# EAGLE schematic gyrotestbench (EAGLE 6.2)

## Sheet 1 of 9
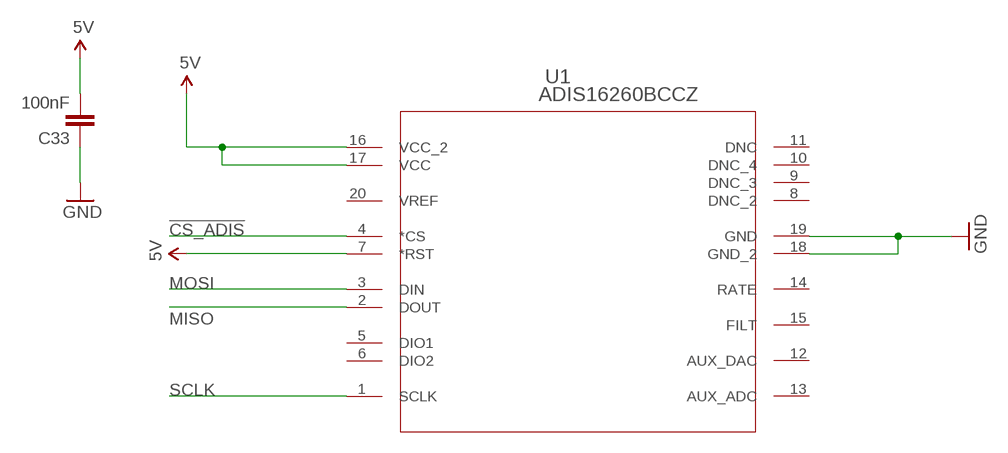
[diagram p0: schematic, sheet 1]

### Parts
C33  100nF  CAP0603-CAP  [0603-CAP]
U1  ADIS16260BCCZ  [LGA_CC-20-1]

### Nets
5V: C33.2 U1.7(*RST) U1.16(VCC_2) U1.17(VCC) ; also sheet 2,3,7,8,9
!CS_ADIS: U1.4(*CS) ; also sheet 9
GND: C33.1 U1.18(GND_2) U1.19(GND) ; also sheet 2,3,4,5,6,7,8,9
MISO: U1.2(DOUT) ; also sheet 2,7,9
MOSI: U1.3(DIN) ; also sheet 2,7,9
SCLK: U1.1(SCLK) ; also sheet 2,7,9
Unconnected: U1.5(DIO1) U1.6(DIO2) U1.8(DNC_2) U1.9(DNC_3) U1.10(DNC_4) U1.11(DNC) U1.12(AUX_DAC) U1.13(AUX_ADC) U1.14(RATE) U1.15(FILT) U1.20(VREF)

## Sheet 2 of 9
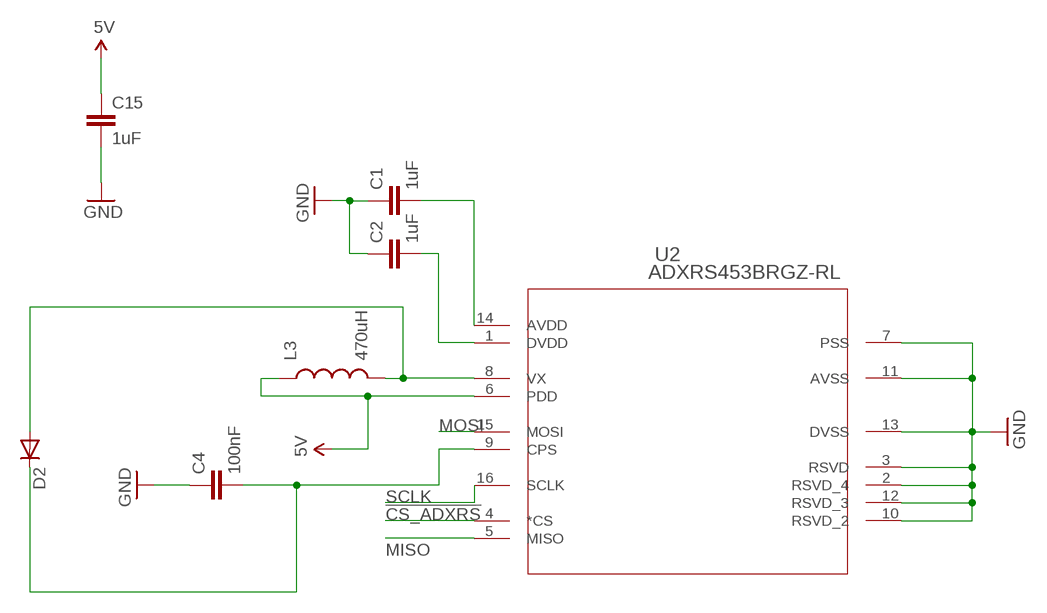
[diagram p1: schematic, sheet 2]

### Parts
C1  1uF  CAP0603-CAP  [0603-CAP]
C2  1uF  CAP0603-CAP  [0603-CAP]
C4  100nF  CAP0603-CAP  [0603-CAP]
C15  1uF  CAP0603-CAP  [0603-CAP]
D2  DIODEPTH  [DIODE-1N4001]
L3  470uH  INDUCTOR1210  [1210]
U2  ADXRS453BRGZ-RL  [RG_16_1]

### Nets
5V: C15.1 L3.1 U2.6(PDD) ; also sheet 1,3,7,8,9
!CS_ADXRS: U2.4(*CS) ; also sheet 9
GND: C1.1 C2.1 C4.1 C15.2 U2.2(RSVD_4) U2.3(RSVD) U2.7(PSS) U2.10(RSVD_2) U2.11(AVSS) U2.12(RSVD_3) U2.13(DVSS) ; also sheet 1,3,4,5,6,7,8,9
MISO: U2.5(MISO) ; also sheet 1,7,9
MOSI: U2.15(MOSI) ; also sheet 1,7,9
N$1: C1.2 U2.14(AVDD)
N$2: C2.2 U2.1(DVDD)
N$3: C4.2 D2.C U2.9(CPS)
N$4: D2.A L3.2 U2.8(VX)
SCLK: U2.16(SCLK) ; also sheet 1,7,9

## Sheet 3 of 9
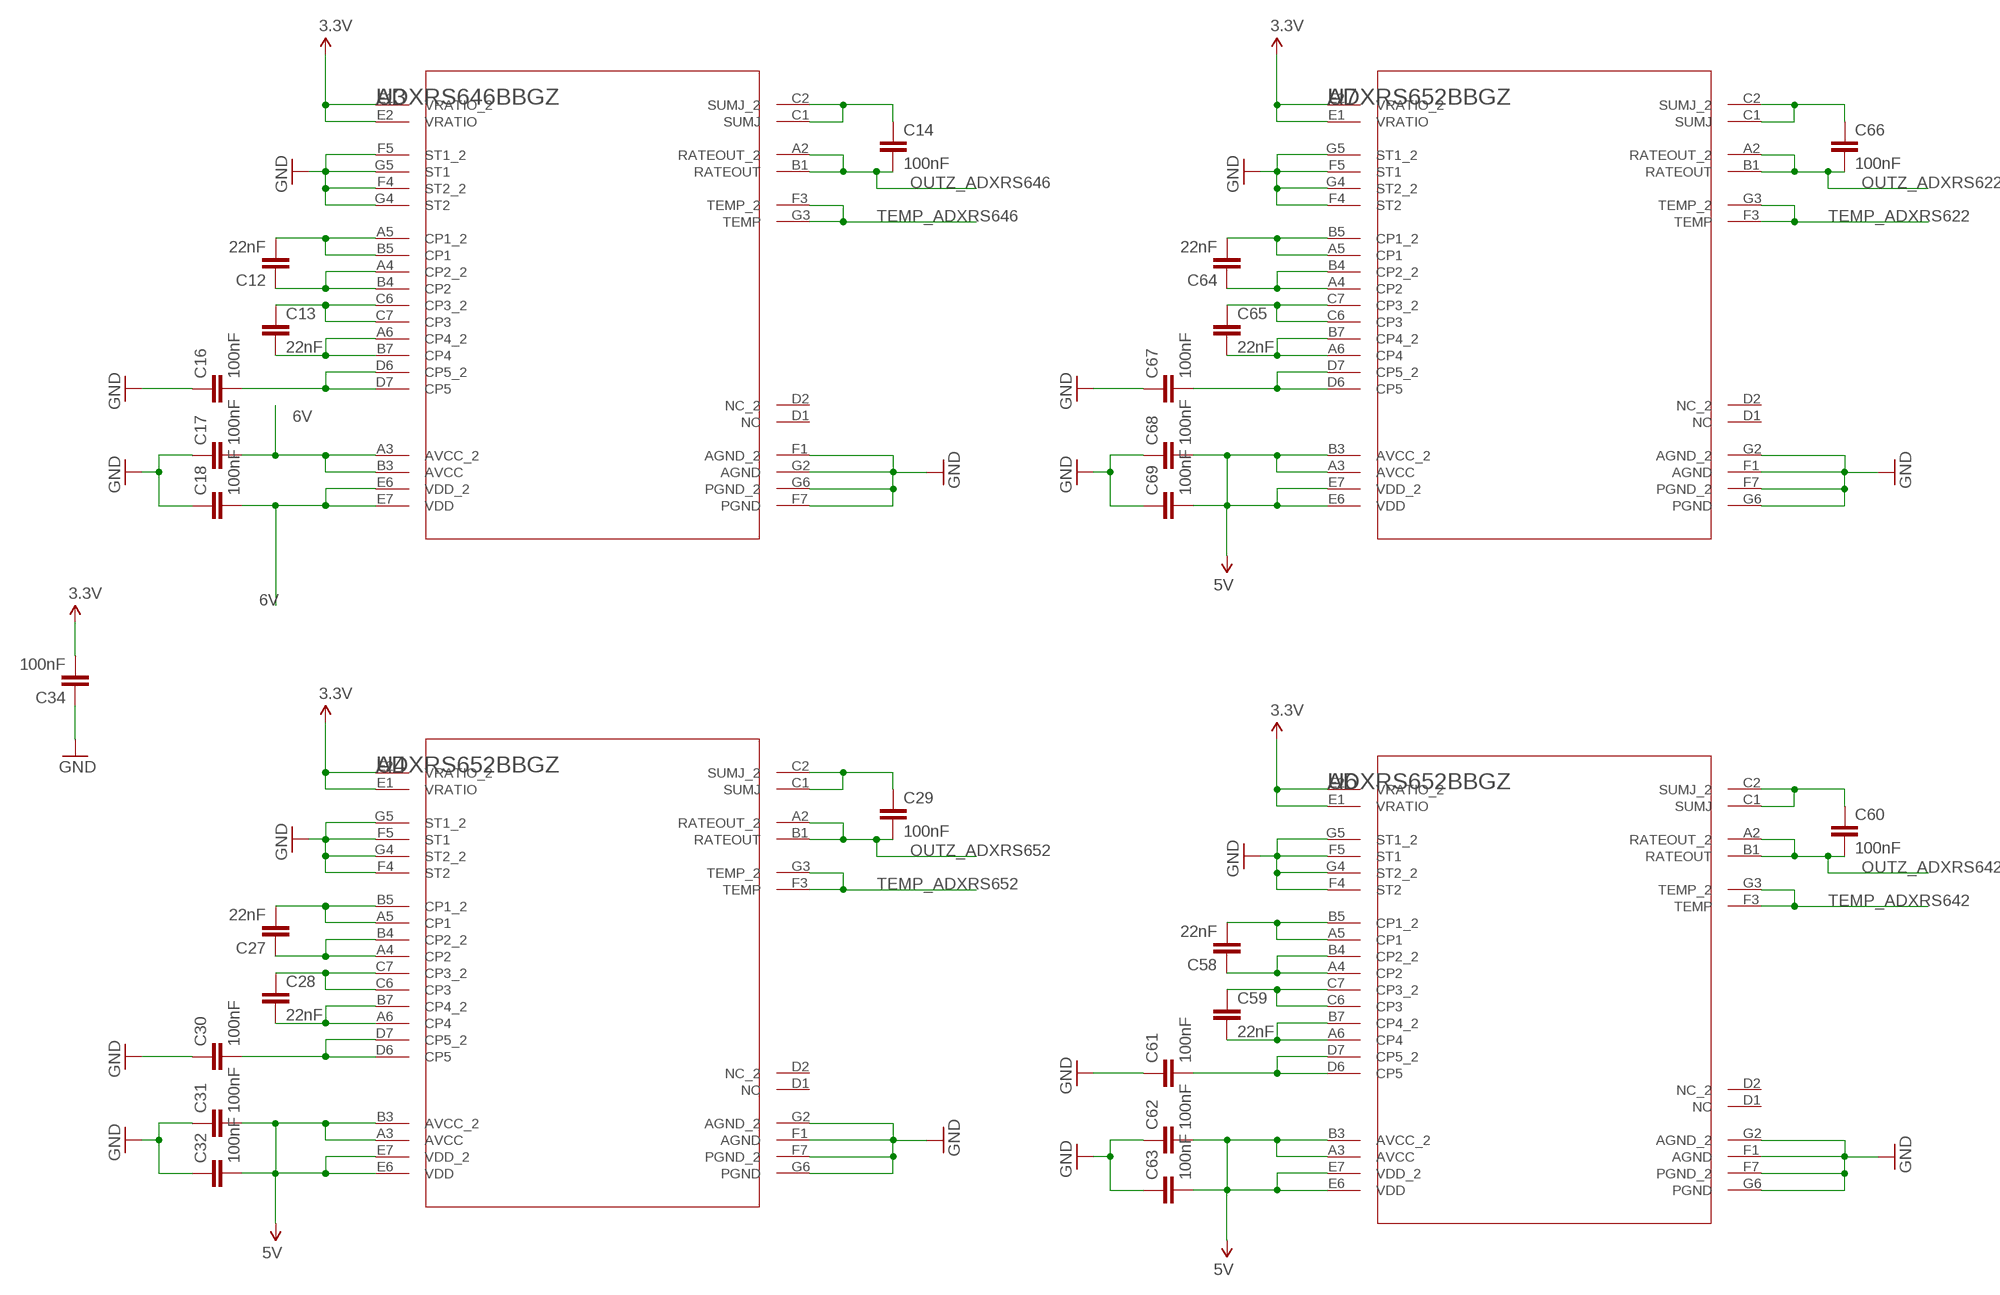
[diagram p2: schematic, sheet 3]

### Parts
C12  22nF  CAP0603-CAP  [0603-CAP]
C13  22nF  CAP0603-CAP  [0603-CAP]
C14  100nF  CAP0603-CAP  [0603-CAP]
C16  100nF  CAP0603-CAP  [0603-CAP]
C17  100nF  CAP0603-CAP  [0603-CAP]
C18  100nF  CAP0603-CAP  [0603-CAP]
C27  22nF  CAP0603-CAP  [0603-CAP]
C28  22nF  CAP0603-CAP  [0603-CAP]
C29  100nF  CAP0603-CAP  [0603-CAP]
C30  100nF  CAP0603-CAP  [0603-CAP]
C31  100nF  CAP0603-CAP  [0603-CAP]
C32  100nF  CAP0603-CAP  [0603-CAP]
C34  100nF  CAP0603-CAP  [0603-CAP]
C58  22nF  CAP0603-CAP  [0603-CAP]
C59  22nF  CAP0603-CAP  [0603-CAP]
C60  100nF  CAP0603-CAP  [0603-CAP]
C61  100nF  CAP0603-CAP  [0603-CAP]
C62  100nF  CAP0603-CAP  [0603-CAP]
C63  100nF  CAP0603-CAP  [0603-CAP]
C64  22nF  CAP0603-CAP  [0603-CAP]
C65  22nF  CAP0603-CAP  [0603-CAP]
C66  100nF  CAP0603-CAP  [0603-CAP]
C67  100nF  CAP0603-CAP  [0603-CAP]
C68  100nF  CAP0603-CAP  [0603-CAP]
C69  100nF  CAP0603-CAP  [0603-CAP]
U3  ADXRS646BBGZ  [BG_32_3]
U4  ADXRS652BBGZ  [BG_32_3]
U6  ADXRS652BBGZ  [BG_32_3]
U7  ADXRS652BBGZ  [BG_32_3]

### Nets
3.3V: C34.2 U3.E1(VRATIO_2) U3.E2(VRATIO) U4.E1(VRATIO) U4.E2(VRATIO_2) U6.E1(VRATIO) U6.E2(VRATIO_2) U7.E1(VRATIO) U7.E2(VRATIO_2) ; also sheet 4,5,6,9
5V: C31.2 C32.2 C62.2 C63.2 C68.2 C69.2 U4.A3(AVCC) U4.B3(AVCC_2) U4.E6(VDD) U4.E7(VDD_2) U6.A3(AVCC) U6.B3(AVCC_2) U6.E6(VDD) U6.E7(VDD_2) U7.A3(AVCC) U7.B3(AVCC_2) U7.E6(VDD) U7.E7(VDD_2) ; also sheet 1,2,7,8,9
6V: C17.2 C18.2 U3.A3(AVCC_2) U3.B3(AVCC) U3.E6(VDD_2) U3.E7(VDD) ; also sheet 8
GND: C16.1 C17.1 C18.1 C30.1 C31.1 C32.1 C34.1 C61.1 C62.1 C63.1 C67.1 C68.1 C69.1 U3.F1(AGND_2) U3.F4(ST2_2) U3.F5(ST1_2) U3.F7(PGND) U3.G2(AGND) U3.G4(ST2) U3.G5(ST1) U3.G6(PGND_2) U4.F1(AGND) U4.F4(ST2) U4.F5(ST1) U4.F7(PGND_2) U4.G2(AGND_2) U4.G4(ST2_2) U4.G5(ST1_2) U4.G6(PGND) U6.F1(AGND) U6.F4(ST2) U6.F5(ST1) U6.F7(PGND_2) U6.G2(AGND_2) U6.G4(ST2_2) U6.G5(ST1_2) U6.G6(PGND) U7.F1(AGND) U7.F4(ST2) U7.F5(ST1) U7.F7(PGND_2) U7.G2(AGND_2) U7.G4(ST2_2) U7.G5(ST1_2) U7.G6(PGND) ; also sheet 1,2,4,5,6,7,8,9
N$8: C12.2 U3.A5(CP1_2) U3.B5(CP1)
N$9: C12.1 U3.A4(CP2_2) U3.B4(CP2)
N$10: C13.1 U3.C6(CP3_2) U3.C7(CP3)
N$11: C13.2 U3.A6(CP4_2) U3.B7(CP4)
N$17: C14.1 U3.C1(SUMJ) U3.C2(SUMJ_2)
N$19: C16.2 U3.D6(CP5_2) U3.D7(CP5)
N$24: C27.2 U4.A5(CP1) U4.B5(CP1_2)
N$25: C27.1 U4.A4(CP2) U4.B4(CP2_2)
N$26: C28.1 U4.C6(CP3) U4.C7(CP3_2)
N$27: C28.2 U4.A6(CP4) U4.B7(CP4_2)
N$28: C29.1 U4.C1(SUMJ) U4.C2(SUMJ_2)
N$29: C30.2 U4.D6(CP5) U4.D7(CP5_2)
N$62: C58.2 U6.A5(CP1) U6.B5(CP1_2)
N$63: C58.1 U6.A4(CP2) U6.B4(CP2_2)
N$64: C59.1 U6.C6(CP3) U6.C7(CP3_2)
N$65: C59.2 U6.A6(CP4) U6.B7(CP4_2)
N$66: C60.1 U6.C1(SUMJ) U6.C2(SUMJ_2)
N$67: C61.2 U6.D6(CP5) U6.D7(CP5_2)
N$68: C64.2 U7.A5(CP1) U7.B5(CP1_2)
N$69: C64.1 U7.A4(CP2) U7.B4(CP2_2)
N$70: C65.1 U7.C6(CP3) U7.C7(CP3_2)
N$71: C65.2 U7.A6(CP4) U7.B7(CP4_2)
N$72: C66.1 U7.C1(SUMJ) U7.C2(SUMJ_2)
N$73: C67.2 U7.D6(CP5) U7.D7(CP5_2)
OUTZ_ADXRS622: C66.2 U7.A2(RATEOUT_2) U7.B1(RATEOUT) ; also sheet 7
OUTZ_ADXRS642: C60.2 U6.A2(RATEOUT_2) U6.B1(RATEOUT) ; also sheet 7
OUTZ_ADXRS646: C14.2 U3.A2(RATEOUT_2) U3.B1(RATEOUT) ; also sheet 7
OUTZ_ADXRS652: C29.2 U4.A2(RATEOUT_2) U4.B1(RATEOUT) ; also sheet 7
TEMP_ADXRS622: U7.F3(TEMP) U7.G3(TEMP_2) ; also sheet 7
TEMP_ADXRS642: U6.F3(TEMP) U6.G3(TEMP_2) ; also sheet 7
TEMP_ADXRS646: U3.F3(TEMP_2) U3.G3(TEMP) ; also sheet 7
TEMP_ADXRS652: U4.F3(TEMP) U4.G3(TEMP_2) ; also sheet 7
Unconnected: U3.D1(NC) U3.D2(NC_2) U4.D1(NC) U4.D2(NC_2) U6.D1(NC) U6.D2(NC_2) U7.D1(NC) U7.D2(NC_2)

## Sheet 4 of 9
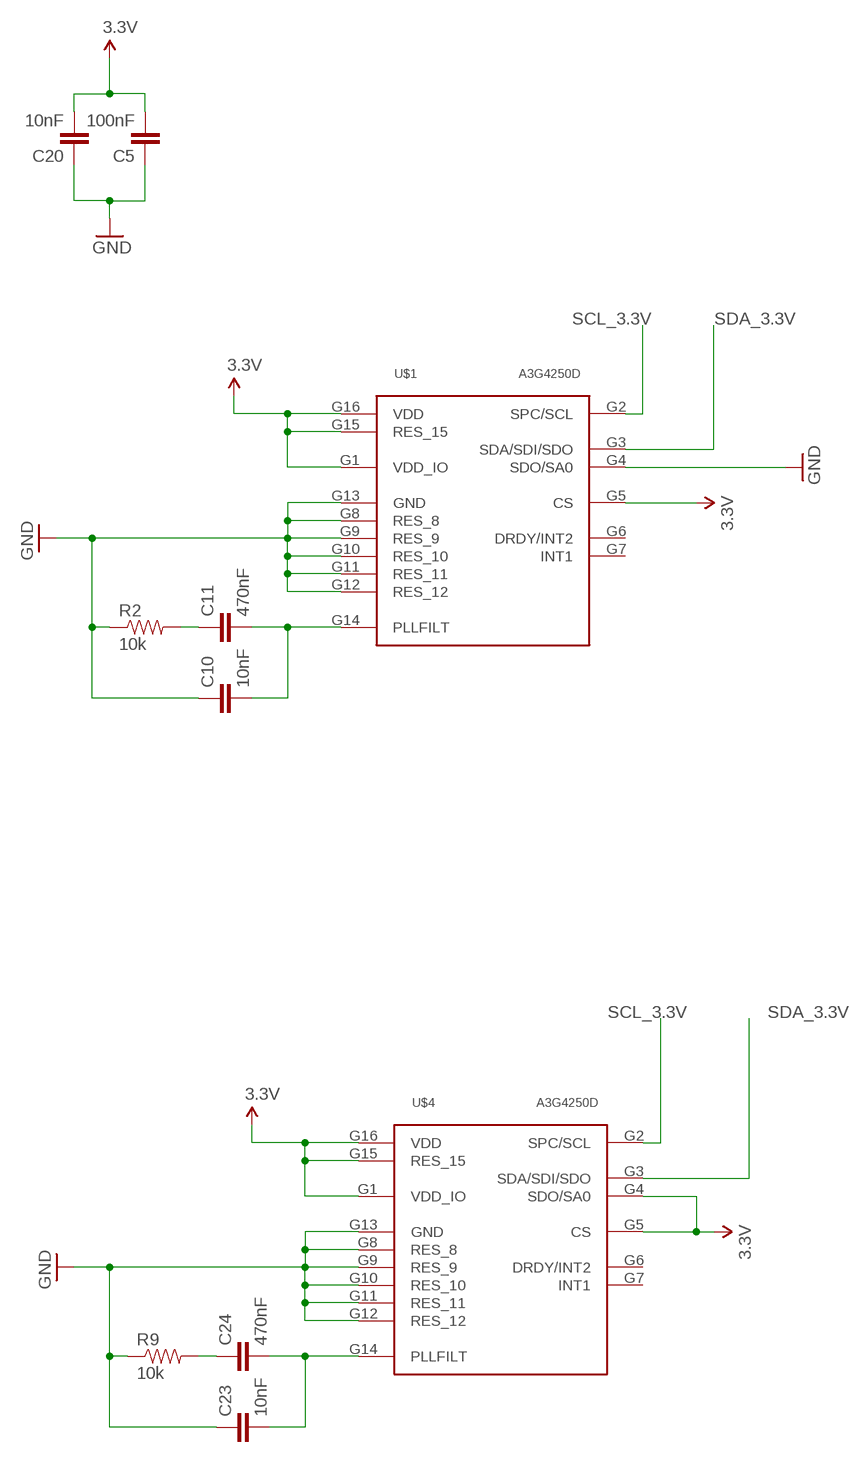
[diagram p3: schematic, sheet 4]

### Parts
C5  100nF  CAP0603-CAP  [0603-CAP]
C10  10nF  CAP0603-CAP  [0603-CAP]
C11  470nF  CAP0603-CAP  [0603-CAP]
C20  10nF  CAP0603-CAP  [0603-CAP]
C23  10nF  CAP0603-CAP  [0603-CAP]
C24  470nF  CAP0603-CAP  [0603-CAP]
R2  10k  RESISTOR0603-RES  [0603-RES]
R9  10k  RESISTOR0603-RES  [0603-RES]
U$1  A3G4250D  [LGA-16]
U$4  A3G4250D  [LGA-16]

### Nets
3.3V: C5.2 C20.2 U$1.G1(VDD_IO) U$1.G5(CS) U$1.G15(RES_15) U$1.G16(VDD) U$4.G1(VDD_IO) U$4.G4(SDO/SA0) U$4.G5(CS) U$4.G15(RES_15) U$4.G16(VDD) ; also sheet 3,5,6,9
GND: C5.1 C10.1 C20.1 C23.1 R2.1 R9.1 U$1.G4(SDO/SA0) U$1.G8(RES_8) U$1.G9(RES_9) U$1.G10(RES_10) U$1.G11(RES_11) U$1.G12(RES_12) U$1.G13(GND) U$4.G8(RES_8) U$4.G9(RES_9) U$4.G10(RES_10) U$4.G11(RES_11) U$4.G12(RES_12) U$4.G13(GND) ; also sheet 1,2,3,5,6,7,8,9
N$12: C10.2 C11.2 U$1.G14(PLLFILT)
N$13: C11.1 R2.2
N$16: C23.2 C24.2 U$4.G14(PLLFILT)
N$21: C24.1 R9.2
SCL_3.3V: U$1.G2(SPC/SCL) U$4.G2(SPC/SCL) ; also sheet 6,9
SDA_3.3V: U$1.G3(SDA/SDI/SDO) U$4.G3(SDA/SDI/SDO) ; also sheet 6,9
Unconnected: U$1.G6(DRDY/INT2) U$1.G7(INT1) U$4.G6(DRDY/INT2) U$4.G7(INT1)

## Sheet 5 of 9
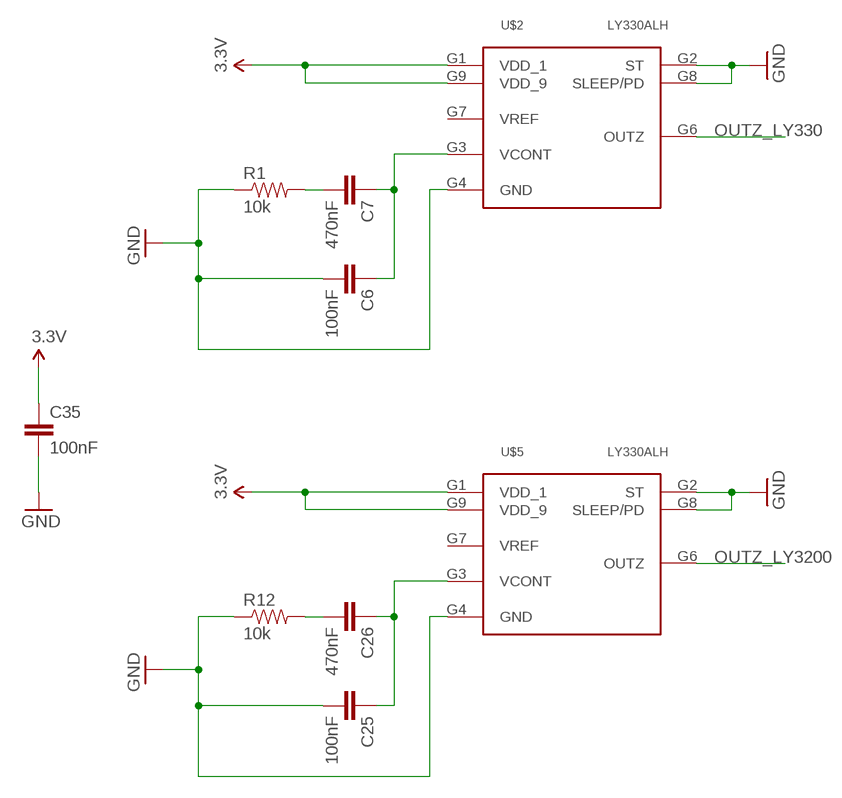
[diagram p4: schematic, sheet 5]

### Parts
C6  100nF  CAP0603-CAP  [0603-CAP]
C7  470nF  CAP0603-CAP  [0603-CAP]
C25  100nF  CAP0603-CAP  [0603-CAP]
C26  470nF  CAP0603-CAP  [0603-CAP]
C35  100nF  CAP0603-CAP  [0603-CAP]
R1  10k  RESISTOR0603-RES  [0603-RES]
R12  10k  RESISTOR0603-RES  [0603-RES]
U$2  LY330ALH  [LGA-10]
U$5  LY330ALH  [LGA-10]

### Nets
3.3V: C35.1 U$2.G1(VDD_1) U$2.G9(VDD_9) U$5.G1(VDD_1) U$5.G9(VDD_9) ; also sheet 3,4,6,9
GND: C6.2 C25.2 C35.2 R1.1 R12.1 U$2.G2(ST) U$2.G4(GND) U$2.G8(SLEEP/PD) U$5.G2(ST) U$5.G4(GND) U$5.G8(SLEEP/PD) ; also sheet 1,2,3,4,6,7,8,9
N$6: C7.2 R1.2
N$7: C6.1 C7.1 U$2.G3(VCONT)
N$22: C25.1 C26.1 U$5.G3(VCONT)
N$23: C26.2 R12.2
OUTZ_LY330: U$2.G6(OUTZ) ; also sheet 7
OUTZ_LY3200: U$5.G6(OUTZ) ; also sheet 7
Unconnected: U$2.G7(VREF) U$5.G7(VREF)

## Sheet 6 of 9
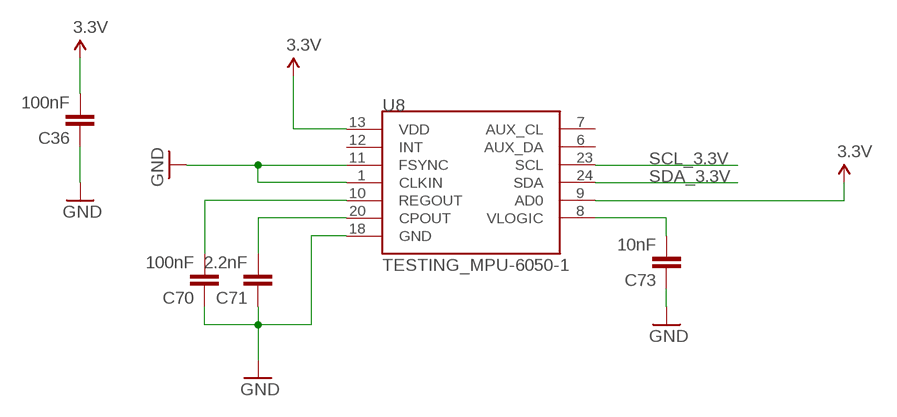
[diagram p5: schematic, sheet 6]

### Parts
C36  100nF  CAP0603-CAP  [0603-CAP]
C70  100nF  CAP0603-CAP  [0603-CAP]
C71  2.2nF  CAP0603-CAP  [0603-CAP]
C73  10nF  CAP0603-CAP  [0603-CAP]
U8  TESTING_MPU-6050-1  [TESTING_QFN-24-4MM2]

### Nets
3.3V: C36.2 U8.9(AD0) U8.13(VDD) ; also sheet 3,4,5,9
GND: C36.1 C70.1 C71.1 C73.1 U8.1(CLKIN) U8.11(FSYNC) U8.18(GND) ; also sheet 1,2,3,4,5,7,8,9
N$38: C70.2 U8.10(REGOUT)
N$39: C71.2 U8.20(CPOUT)
N$41: C73.2 U8.8(VLOGIC)
SCL_3.3V: U8.23(SCL) ; also sheet 4,9
SDA_3.3V: U8.24(SDA) ; also sheet 4,9
Unconnected: U8.6(AUX_DA) U8.7(AUX_CL) U8.12(INT)

## Sheet 7 of 9
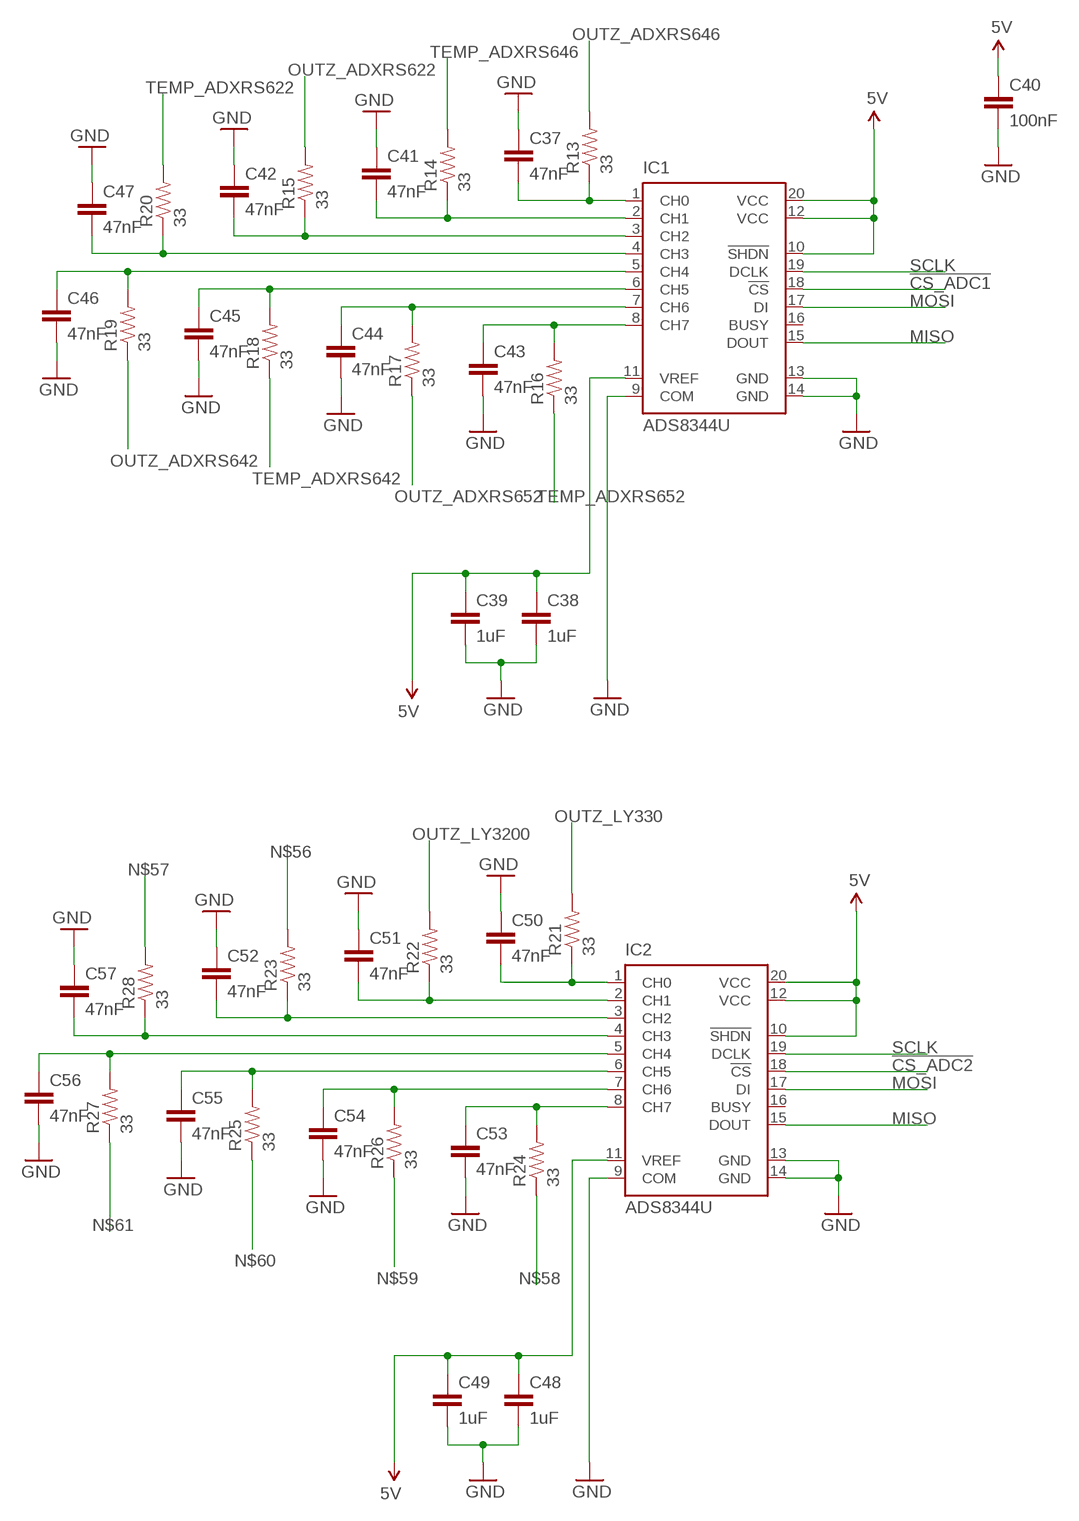
[diagram p6: schematic, sheet 7]

### Parts
C37  47nF  CAP0603-CAP  [0603-CAP]
C38  1uF  CAP0603-CAP  [0603-CAP]
C39  1uF  CAP0603-CAP  [0603-CAP]
C40  100nF  CAP0603-CAP  [0603-CAP]
C41  47nF  CAP0603-CAP  [0603-CAP]
C42  47nF  CAP0603-CAP  [0603-CAP]
C43  47nF  CAP0603-CAP  [0603-CAP]
C44  47nF  CAP0603-CAP  [0603-CAP]
C45  47nF  CAP0603-CAP  [0603-CAP]
C46  47nF  CAP0603-CAP  [0603-CAP]
C47  47nF  CAP0603-CAP  [0603-CAP]
C48  1uF  CAP0603-CAP  [0603-CAP]
C49  1uF  CAP0603-CAP  [0603-CAP]
C50  47nF  CAP0603-CAP  [0603-CAP]
C51  47nF  CAP0603-CAP  [0603-CAP]
C52  47nF  CAP0603-CAP  [0603-CAP]
C53  47nF  CAP0603-CAP  [0603-CAP]
C54  47nF  CAP0603-CAP  [0603-CAP]
C55  47nF  CAP0603-CAP  [0603-CAP]
C56  47nF  CAP0603-CAP  [0603-CAP]
C57  47nF  CAP0603-CAP  [0603-CAP]
IC1  ADS8344U  [SSOP20BU]
IC2  ADS8344U  [SSOP20BU]
R13  33  RESISTOR0603-RES  [0603-RES]
R14  33  RESISTOR0603-RES  [0603-RES]
R15  33  RESISTOR0603-RES  [0603-RES]
R16  33  RESISTOR0603-RES  [0603-RES]
R17  33  RESISTOR0603-RES  [0603-RES]
R18  33  RESISTOR0603-RES  [0603-RES]
R19  33  RESISTOR0603-RES  [0603-RES]
R20  33  RESISTOR0603-RES  [0603-RES]
R21  33  RESISTOR0603-RES  [0603-RES]
R22  33  RESISTOR0603-RES  [0603-RES]
R23  33  RESISTOR0603-RES  [0603-RES]
R24  33  RESISTOR0603-RES  [0603-RES]
R25  33  RESISTOR0603-RES  [0603-RES]
R26  33  RESISTOR0603-RES  [0603-RES]
R27  33  RESISTOR0603-RES  [0603-RES]
R28  33  RESISTOR0603-RES  [0603-RES]

### Nets
5V: C38.1 C39.1 C40.1 C48.1 C49.1 IC1.10(!SHDN) IC1.11(VREF) IC1.12(VCC) IC1.20(VCC) IC2.10(!SHDN) IC2.11(VREF) IC2.12(VCC) IC2.20(VCC) ; also sheet 1,2,3,8,9
!CS_ADC1: IC1.18(!CS) ; also sheet 9
!CS_ADC2: IC2.18(!CS) ; also sheet 9
GND: C37.1 C38.2 C39.2 C40.2 C41.1 C42.1 C43.2 C44.2 C45.2 C46.2 C47.1 C48.2 C49.2 C50.1 C51.1 C52.1 C53.2 C54.2 C55.2 C56.2 C57.1 IC1.9(COM) IC1.13(GND) IC1.14(GND) IC2.9(COM) IC2.13(GND) IC2.14(GND) ; also sheet 1,2,3,4,5,6,8,9
MISO: IC1.15(DOUT) IC2.15(DOUT) ; also sheet 1,2,9
MOSI: IC1.17(DI) IC2.17(DI) ; also sheet 1,2,9
N$30: C37.2 IC1.1(CH0) R13.1
N$31: C41.2 IC1.2(CH1) R14.1
N$32: C42.2 IC1.3(CH2) R15.1
N$33: C43.1 IC1.8(CH7) R16.2
N$34: C44.1 IC1.7(CH6) R17.2
N$35: C45.1 IC1.6(CH5) R18.2
N$36: C47.2 IC1.4(CH3) R20.1
N$37: C46.1 IC1.5(CH4) R19.2
N$46: C50.2 IC2.1(CH0) R21.1
N$47: C51.2 IC2.2(CH1) R22.1
N$48: C52.2 IC2.3(CH2) R23.1
N$49: C53.1 IC2.8(CH7) R24.2
N$50: C54.1 IC2.7(CH6) R26.2
N$51: C55.1 IC2.6(CH5) R25.2
N$52: C57.2 IC2.4(CH3) R28.1
N$53: C56.1 IC2.5(CH4) R27.2
N$56: R23.2
N$57: R28.2
N$58: R24.1
N$59: R26.1
N$60: R25.1
N$61: R27.1
OUTZ_ADXRS622: R15.2 ; also sheet 3
OUTZ_ADXRS642: R19.1 ; also sheet 3
OUTZ_ADXRS646: R13.2 ; also sheet 3
OUTZ_ADXRS652: R17.1 ; also sheet 3
OUTZ_LY330: R21.2 ; also sheet 5
OUTZ_LY3200: R22.2 ; also sheet 5
SCLK: IC1.19(DCLK) IC2.19(DCLK) ; also sheet 1,2,9
TEMP_ADXRS622: R20.2 ; also sheet 3
TEMP_ADXRS642: R18.1 ; also sheet 3
TEMP_ADXRS646: R14.2 ; also sheet 3
TEMP_ADXRS652: R16.1 ; also sheet 3
Unconnected: IC1.16(BUSY) IC2.16(BUSY)

## Sheet 8 of 9
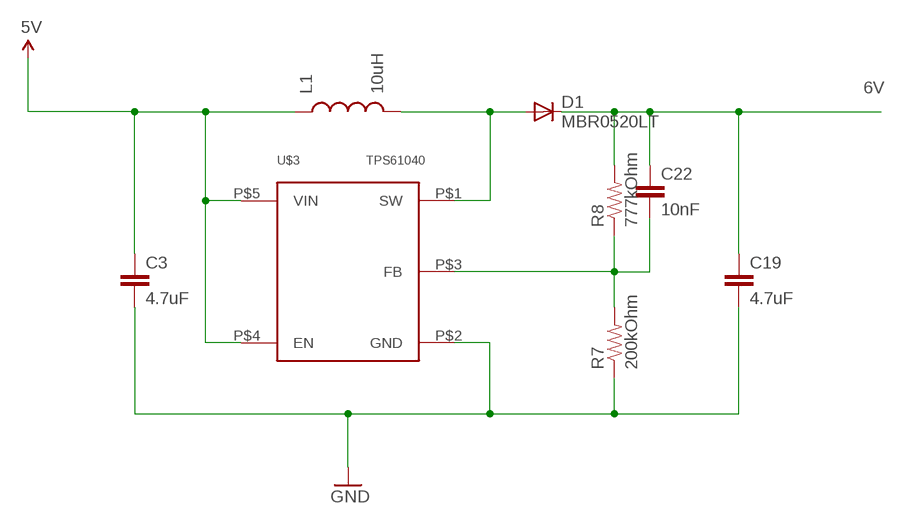
[diagram p7: schematic, sheet 8]

### Parts
C3  4.7uF  CAP0603-CAP  [0603-CAP]
C19  4.7uF  CAP0603-CAP  [0603-CAP]
C22  10nF  CAP0603-CAP  [0603-CAP]
D1  MBR0520LT  [SOD123]
L1  10uH  INDUCTOR1210  [1210]
R7  200kOhm  RESISTOR0603-RES  [0603-RES]
R8  777kOhm  RESISTOR0603-RES  [0603-RES]
U$3  TPS61040  [DBV]

### Nets
5V: C3.1 L1.1 U$3.P$4(EN) U$3.P$5(VIN) ; also sheet 1,2,3,7,9
6V: C19.1 C22.1 D1.C R8.2 ; also sheet 3
GND: C3.2 C19.2 R7.1 U$3.P$2(GND) ; also sheet 1,2,3,4,5,6,7,9
N$18: D1.A L1.2 U$3.P$1(SW)
N$20: C22.2 R7.2 R8.1 U$3.P$3(FB)

## Sheet 9 of 9
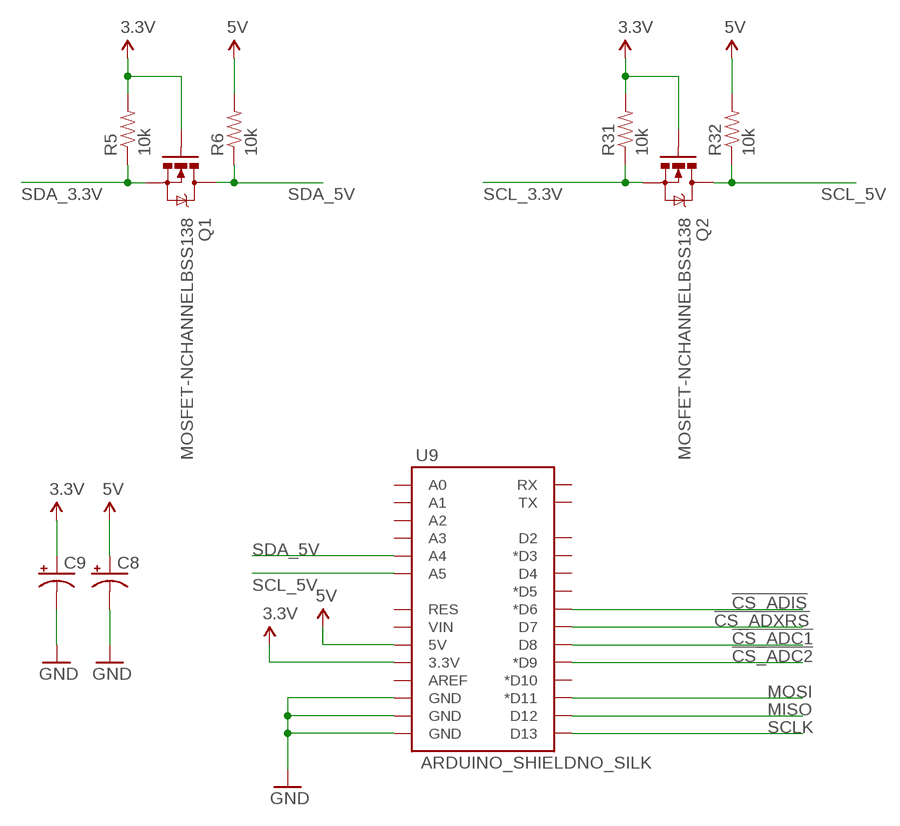
[diagram p8: schematic, sheet 9]

### Parts
C8  CPOL-USB  [PANASONIC_B]
C9  CPOL-USB  [PANASONIC_B]
Q1  MOSFET-NCHANNELBSS138  [SOT23]
Q2  MOSFET-NCHANNELBSS138  [SOT23]
R5  10k  RESISTOR0603-RES  [0603-RES]
R6  10k  RESISTOR0603-RES  [0603-RES]
R31  10k  RESISTOR0603-RES  [0603-RES]
R32  10k  RESISTOR0603-RES  [0603-RES]
U9  ARDUINO_SHIELDNO_SILK  [DUEMILANOVE_VIAS]

### Nets
3.3V: C9.+ Q1.1(G) Q2.1(G) R5.2 R31.2 U9.3.3V ; also sheet 3,4,5,6
5V: C8.+ R6.2 R32.2 U9.5V ; also sheet 1,2,3,7,8
!CS_ADC1: U9.D8 ; also sheet 7
!CS_ADC2: U9.D9(*D9) ; also sheet 7
!CS_ADIS: U9.D6(*D6) ; also sheet 1
!CS_ADXRS: U9.D7 ; also sheet 2
GND: C8.- C9.- U9.GND@0(GND) U9.GND@1(GND) U9.GND@2(GND) ; also sheet 1,2,3,4,5,6,7,8
MISO: U9.D12 ; also sheet 1,2,7
MOSI: U9.D11(*D11) ; also sheet 1,2,7
SCL_3.3V: Q2.2(S) R31.1 ; also sheet 4,6
SCL_5V: Q2.3(D) R32.1 U9.A5
SCLK: U9.D13 ; also sheet 1,2,7
SDA_3.3V: Q1.2(S) R5.1 ; also sheet 4,6
SDA_5V: Q1.3(D) R6.1 U9.A4
Unconnected: U9.A0 U9.A1 U9.A2 U9.A3 U9.AREF U9.D2 U9.D3(*D3) U9.D4 U9.D5(*D5) U9.D10(*D10) U9.RES U9.RX U9.TX U9.VIN

## Library data of the parts
C1-C7 C10-C20 C22-C71 C73 = SparkFun-Capacitors:CAP: Capacitor Standard 0603 ceramic capacitor, and 0.1" leaded capacitor.
C8 C9 = rcl:CPOL-US: POLARIZED CAPACITOR, American symbol
D1 = diode:MBR0520LT: SCHOTTKY BARRIER RECTIFIER Source: http://onsemi.com .. MBR0520LT1-D.pdf
D2 = SparkFun-DiscreteSemi:DIODE: Diode These are standard reverse protection diodes and small signal diodes. SMA package can handle up to about 1A. SOD-323 can handle about 200mA. What the SOD-323 package when ordering, there are some mfgs out there that are 5-pin packages.
IC1 IC2 = burr-brown:ADS8344: 16-Bit, 8-Channel Serial Output Sampling ADC; MPN: ADS8344NB; OC_FARNELL: 1212294; OC_NEWARK: 01M6827
L1 L3 = SparkFun-Passives:INDUCTOR: Inductors Basic Inductor/Choke - 0603 and 1206. Footprints are not proven and vary greatly between part numbers.
Q1 Q2 = SparkFun-DiscreteSemi:MOSFET-NCHANNEL: Common NMOSFET Parts MFG P/N Store ID Prod ID FDD8780 TRANS-09984 SI7820DN TRANS-11055 FDS6630A IC-08089 2N7002PW TRANS-11151 FQP30N06L COM-10213 TRANS-10060 BSS123LT1G TRANS-08345 BSS138 TRANS-00830 BS170 2N7000; PROD_ID: TRANS-00830
R1 R2 R5-R9 R12-R28 R31 R32 = SparkFun-Resistors:RESISTOR: Resistor Basic schematic elements and footprints for 0603, 1206, and PTH resistors.
U1 = gyrolib:ADIS16260BCCZ
U2 = gyrolib:ADXRS453BRGZ-RL
U3 = gyrolib:ADXRS646BBGZ; MANUFACTURER_PART_NUMBER: ADXRS613BBGZ; VENDOR: Vendor
U4 U6 U7 = gyrolib:ADXRS652BBGZ
U8 = MPU-6050_Breakout_V11:TESTING_MPU-6050
U9 = SparkFun-Boards:ARDUINO_SHIELD: Arduino shield footprint
U$1 U$4 = gyrolib:A3G4250D
U$2 U$5 = gyrolib:LY330ALH
U$3 = gyrolib:TPS61040